# EasyEDA Pro project 51单片机.epro

# Schematic 51单片机核心板原理图
Board Name: 51单片机核心板; Create Date: 2025-05-10; Page Name: P1; Project Name: expertlearning; Schematic Name: 51单片机核心板原理图; Update Date: 2025-05-10; Company: 东北林业大学; Drawed: runb0t; Page Size: A4; Version: V1.0
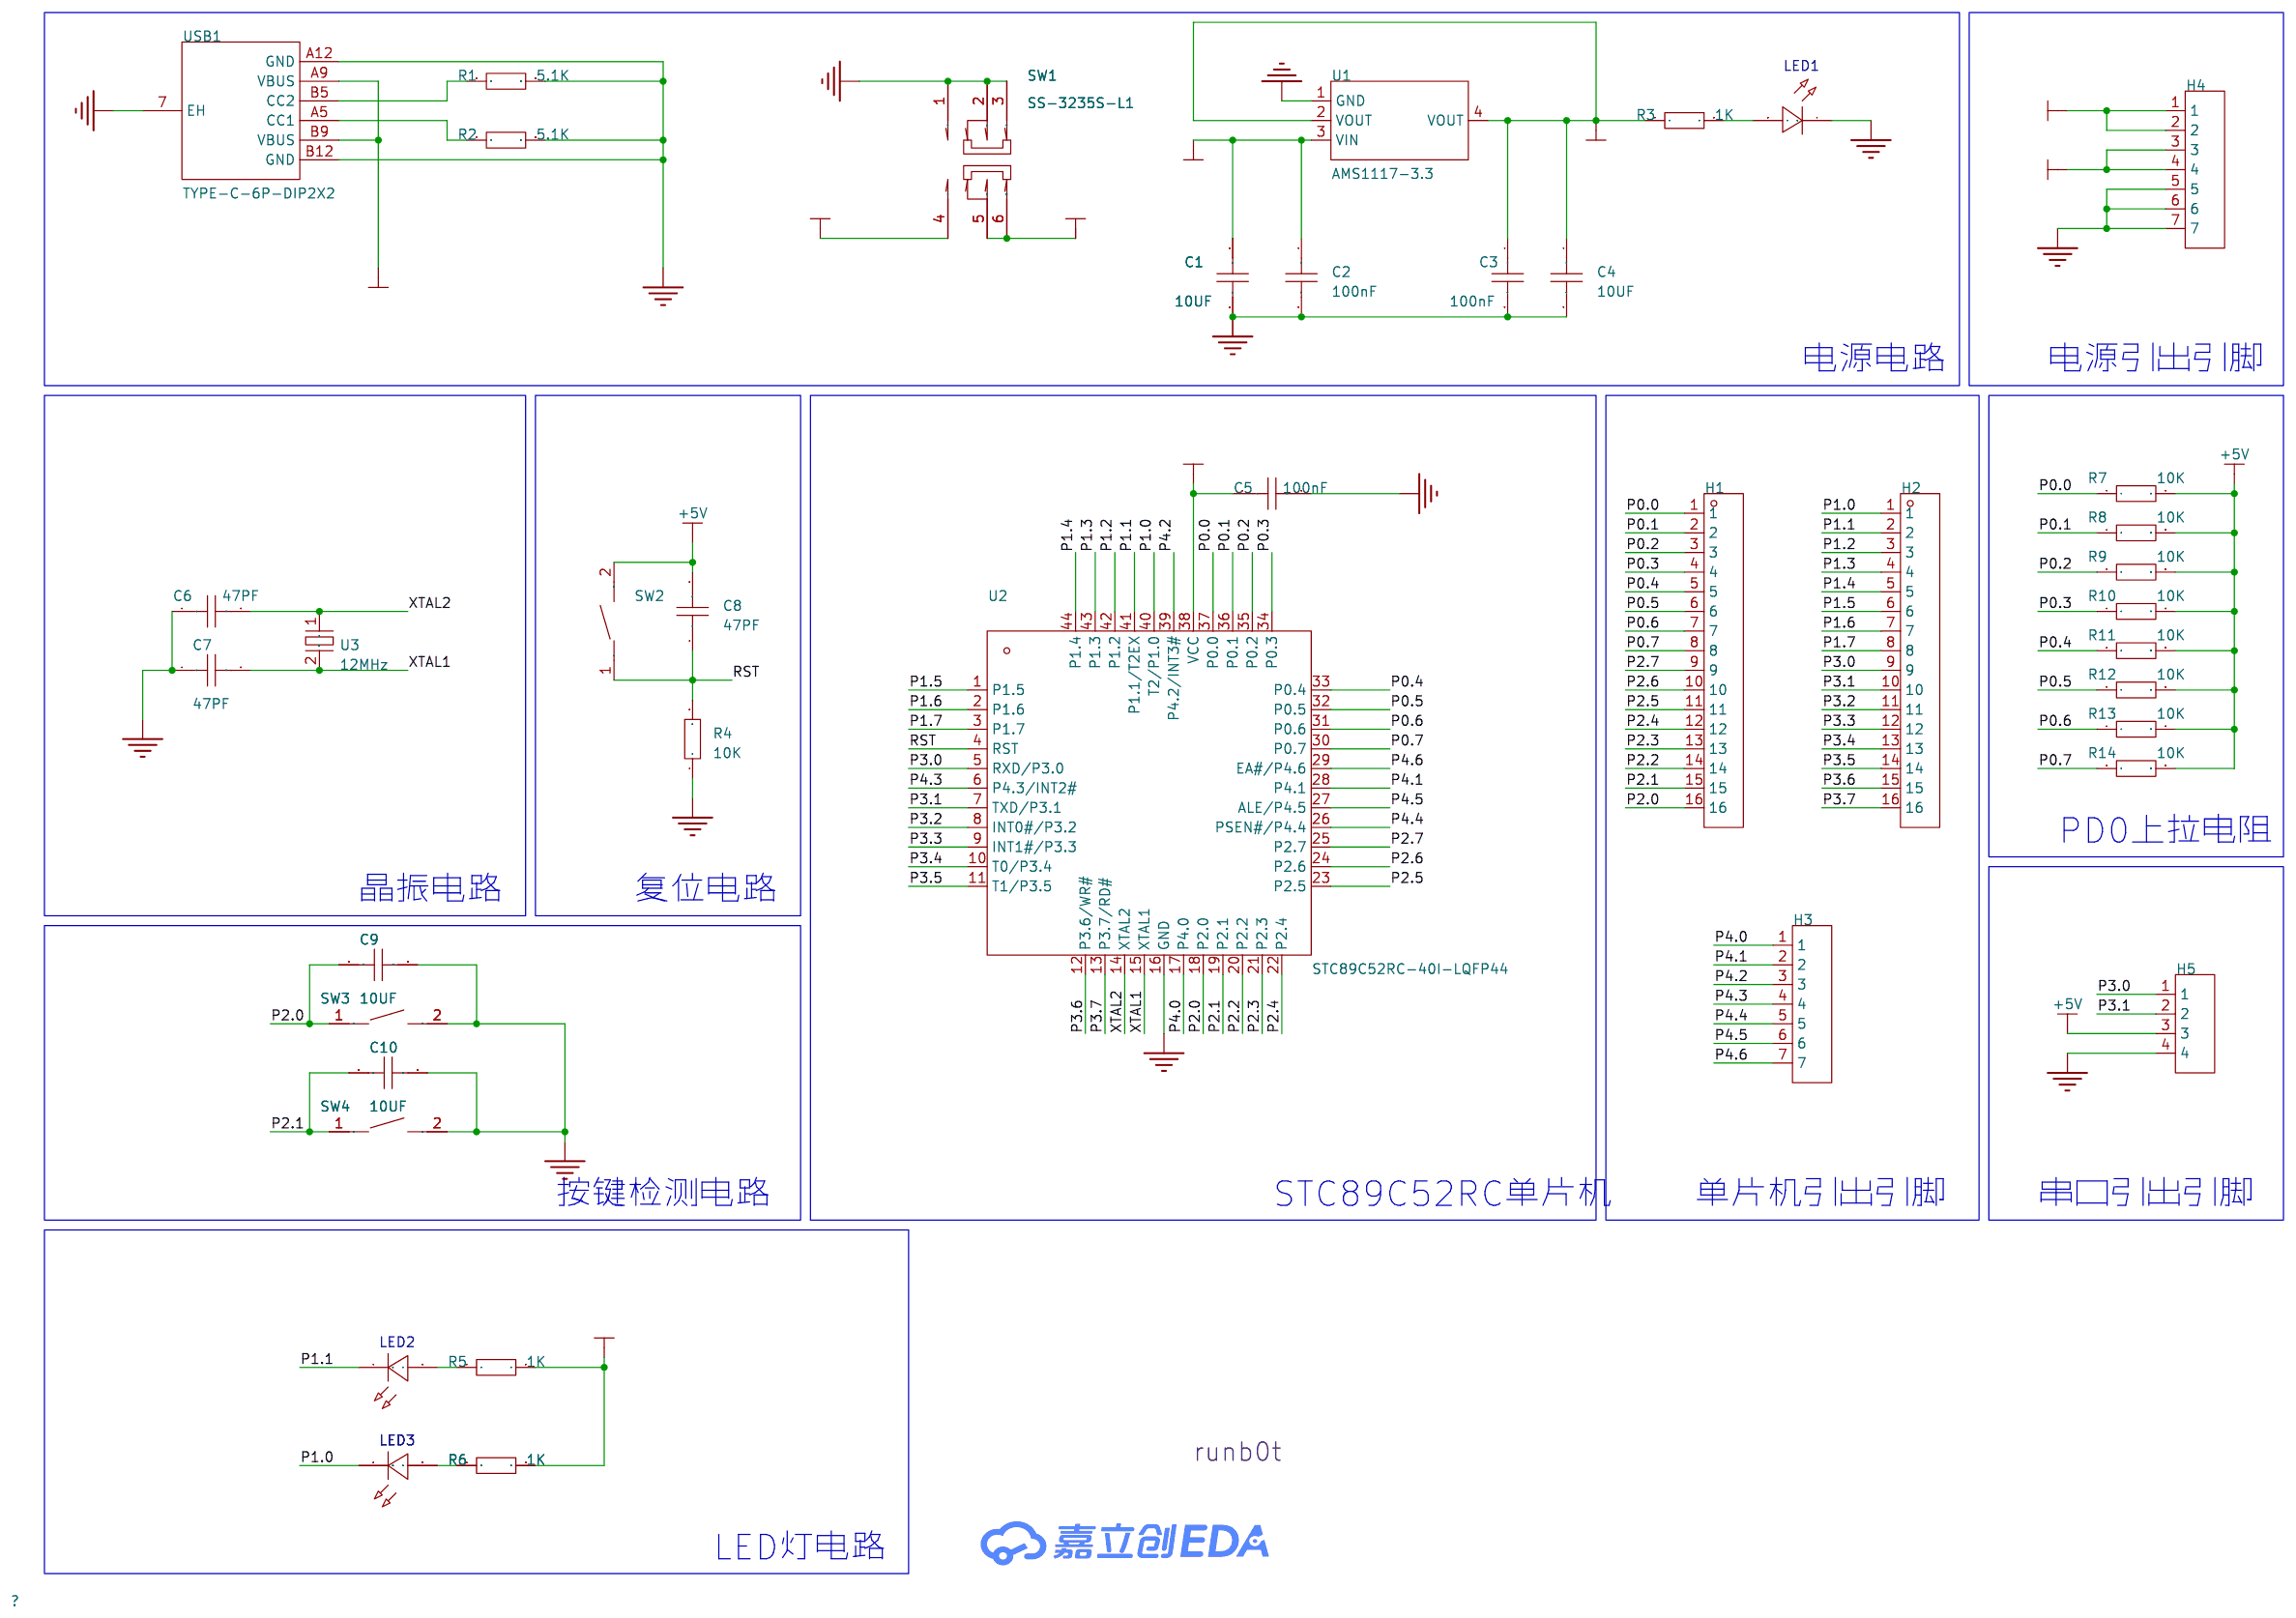
[diagram p0: schematic sheet]

## Parts
C1  10UF  [C0805]
C2  100nF  [C0805]
C3  100nF  [C0805]
C4  10UF  [C0805]
C5  100nF  [C0805]
C6  47PF  [C0805]
C7  47PF  [C0805]
C8  47PF  [C0805]
C9  10UF  [C0805]
C10  10UF  [C0805]
H1  -  [HDR-TH_16P-P2.54-V-M]
H2  -  [HDR-TH_16P-P2.54-V-M]
H3  -  [HDR-TH_7P-P2.54-V-M]
H4  -  [HDR-TH_7P-P2.54-V-M]
H5  -  [HDR-TH_4P-P2.54-V-M]
LED1  -  [LED_0805]
LED2  -  [LED_0805]
LED3  -  [LED_0805]
R1  5.1K  [R0805]
R2  5.1K  [R0805]
R3  1K  [R0805]
R4  10K  [R0805]
R5  1K  [R0805]
R6  1K  [R0805]
R7  10K  [R0805]
R8  10K  [R0805]
R9  10K  [R0805]
R10  10K  [R0805]
R11  10K  [R0805]
R12  10K  [R0805]
R13  10K  [R0805]
R14  10K  [R0805]
SW1  SS-3235S-L1  [SW-SMD_SS-3235S-LX]
SW2  轻触按键3*4*H  [SW-SMD_L4.0-W2.9-LS5.0]
SW3  轻触按键3*4*H  [SW-SMD_L4.0-W2.9-LS5.0]
SW4  轻触按键3*4*H  [SW-SMD_L4.0-W2.9-LS5.0]
U1  AMS1117-3.3  [SOT-223-3_L6.5-W3.4-P2.30-LS7.0-BR]
U2  STC89C52RC-40I-LQFP44  [LQFP-44_L10.0-W10.0-P0.80-LS12.0-BL]
U3  12MHz  [CRYSTAL-SMD_L11.4-W4.7-LS12.7]
USB1  TYPE-C-6P-DIP2X2  [TYPE-C-SMD_TYPE-C-6P]

## Library data of the parts
C1-C10 = CAP_0805: Supplier Footprint: 0805
H1 H2 = HDR-M_2.54_1x16P: 间距:2.54mm;总PIN位数:16;排数:1;插针结构:1x16P;行距:-;安装类型:直插;圆针/方针:方针;额定电流:3A;额定电压:-;配合针长度:6mm;塑高:2.5mm;端接针长度:3mm;触头材质:-;工作温度范围:-40℃~+105℃;颜色:黑色;; Supplier Part: C2894939; Supplier Footprint: 插件
H3 H4 = HDR-M_2.54_1x7P: Supplier Part: C492406; Supplier Footprint: 插件
H5 = HDR-M_2.54_1x4P: Supplier Part: C492403; Supplier Footprint: 插件
LED1-LED3 = LED_0805-G: Supplier Footprint: 0805
R1-R14 = Res_0805: Supplier Footprint: 0805
SW1 = SS-3235S-L1: 电路结构:双刀双掷;安装方式:卧贴;开关颜色:黑色;额定电流(DC):50mA;额定电压(DC):12V;额定电流(AC):50mA;额定电压(AC):12V;机械寿命:1万次;; LCSC Part Name: 柄长2mm 卧贴双档 滑动开关; Supplier Part: C500055; Manufacturer: XKB Connectivity(中国星坤); Supplier Footprint: SMD; JLCPCB Part Class: 扩展库; Datasheet: https://atta.szlcsc.com/upload/public/pdf/source/20211011/39D516E750C13BE9339464E723D9F132.pdf; Supplier: LCSC; Circuit: 双刀双掷; Actuator Style: 矩形柱状; Pin Style: 鸥翼型; Switch Length: 9.1mm; Switch Width: 3.55mm; Switch Height: 3.2mm; Mounting Style: 卧贴; Actuator Color: 黑色; Current Rating (DC): 50mA; Voltage Rating (DC): 12V; Current Rating (AC): 50mA; Voltage Rating (AC): 12V; Mechanical Life: 1万次; Operating Temperature: -40℃~+85℃
SW2-SW4 = 轻触按键3*4*H: Supplier Part: C9900017573; Supplier Footprint: 轻触按键3*4*2.5; JLCPCB Part Class: 扩展库; Supplier: LCSC
U1 = AMS1117-3.3_C6186: 输出类型:固定;工作电压:-;输出电压:3.3V;输出电流:1A;电源纹波抑制比(PSRR):72dB@(120Hz);输出极性:正极;; LCSC Part Name: 输出3.3V 1A; Supplier Part: C6186; Manufacturer: AMS; Supplier Footprint: SOT-223; JLCPCB Part Class: 基础库; Datasheet: https://atta.szlcsc.com/upload/public/pdf/source/20180727/C6186_7A095716F0823C02F1997A905E26C086.pdf; Supplier: LCSC; Output Type: 固定; Output Voltage: 3.3V; Output Current: 1A; Power Supply Rejection Ratio (PSRR): 72dB@(120Hz); Voltage Dropout: 1.3V@(800mA); Features: 过流保护(OCP)；热关断(TSD); Output Configuration: 正极; Number of Outputs: 1
U2 = STC89C52RC-40I-LQFP44: CPU内核:51系列;应用领域:-;; Supplier Part: C8707; Manufacturer: STC; Supplier Footprint: LQFP-44(10x10); JLCPCB Part Class: 扩展库; Datasheet: https://atta.szlcsc.com/upload/public/pdf/source/20241226/242305099CBBF4767F79975207B2F263.pdf; Supplier: LCSC; CPU Core: 51系列; Program Storage Size: 8KB; Program Memory Type: FLASH; Number of I/O: 39; Low Voltage Detection Threshold: 3.3V~5.5V
U3 = ABLS-12.000MHZ-B4H-T: 频率:12MHz;常温频差:±30ppm;外接负载电容:18pF;频率稳定度(全温):±35ppm;; LCSC Part Name: 12MHz ±30ppm 18pF; Supplier Part: C1986452; Manufacturer: ABRACON; Supplier Footprint: HC-49S-SMD; JLCPCB Part Class: 扩展库; Datasheet: https://atta.szlcsc.com/upload/public/pdf/source/20210612/96A8D0E14BE5C26ADD56CBF11909D043.pdf; Supplier: LCSC; Normal temperature Frequency Tolerance: ±30ppm; External load capacitor: 18pF; Frequency Stability(Full temperature range): ±35ppm; Equivalent Series Resistance (ESR): 50Ω; Operating Temperature: -20℃~+70℃
USB1 = TYPE-C-6P-DIP2X2: Supplier Part: C9900017627; Supplier Footprint: TYPE-C-6P; JLCPCB Part Class: 扩展库; Supplier: LCSC

## Nets
3.3V: C3.1 C4.1 H4.3 H4.4 R3.1 R5.2 R6.2 U1.2(VOUT) U1.4(VOUT)
+5V: C1.1 C2.1 C5.1 C8.2 H4.1 H4.2 H5.3 R7.2 R8.2 R9.2 R10.2 R11.2 R12.2 R13.2 R14.2 SW1.5 SW1.6 SW2.2 U1.3(VIN) U2.38(VCC)
GND: C1.2 C2.2 C3.2 C4.2 C5.2 C6.1 C7.1 C9.2 C10.2 H4.5 H4.6 H4.7 H5.4 LED1.1(C) R1.2 R2.2 R4.1 SW1.1 SW1.2 SW1.3 SW3.2 SW4.2 U1.1(GND) U2.16(GND) USB1.7(EH) USB1.A12(GND) USB1.B12(GND)
VCC+5V: SW1.4 USB1.A9(VBUS) USB1.B9(VBUS)
P0.0: H1.1 R7.1 U2.37(P0.0)
P0.1: H1.2 R8.1 U2.36(P0.1)
P0.2: H1.3 R9.1 U2.35(P0.2)
P0.3: H1.4 R10.1 U2.34(P0.3)
P0.4: H1.5 R11.1 U2.33(P0.4)
P0.5: H1.6 R12.1 U2.32(P0.5)
P0.6: H1.7 R13.1 U2.31(P0.6)
P0.7: H1.8 R14.1 U2.30(P0.7)
P1.0: H2.1 LED3.1(C) U2.40(T2/P1.0)
P1.1: H2.2 LED2.1(C) U2.41(P1.1/T2EX)
P1.2: H2.3 U2.42(P1.2)
P1.3: H2.4 U2.43(P1.3)
P1.4: H2.5 U2.44(P1.4)
P1.5: H2.6 U2.1(P1.5)
P1.6: H2.7 U2.2(P1.6)
P1.7: H2.8 U2.3(P1.7)
P2.0: C9.1 H1.16 SW3.1 U2.18(P2.0)
P2.1: C10.1 H1.15 SW4.1 U2.19(P2.1)
P2.2: H1.14 U2.20(P2.2)
P2.3: H1.13 U2.21(P2.3)
P2.4: H1.12 U2.22(P2.4)
P2.5: H1.11 U2.23(P2.5)
P2.6: H1.10 U2.24(P2.6)
P2.7: H1.9 U2.25(P2.7)
P3.0: H2.9 H5.1 U2.5(RXD/P3.0)
P3.1: H2.10 H5.2 U2.7(TXD/P3.1)
P3.2: H2.11 U2.8(INT0#/P3.2)
P3.3: H2.12 U2.9(INT1#/P3.3)
P3.4: H2.13 U2.10(T0/P3.4)
P3.5: H2.14 U2.11(T1/P3.5)
P3.6: H2.15 U2.12(P3.6/WR#)
P3.7: H2.16 U2.13(P3.7/RD#)
P4.0: H3.1 U2.17(P4.0)
P4.1: H3.2 U2.28(P4.1)
P4.2: H3.3 U2.39(P4.2/INT3#)
P4.3: H3.4 U2.6(P4.3/INT2#)
P4.4: H3.5 U2.26(PSEN#/P4.4)
P4.5: H3.6 U2.27(ALE/P4.5)
P4.6: H3.7 U2.29(EA#/P4.6)
RST: C8.1 R4.2 SW2.1 U2.4(RST)
XTAL1: C7.2 U2.15(XTAL1) U3.2(GND)
XTAL2: C6.2 U2.14(XTAL2) U3.1
$1N6250: R1.1 USB1.B5(CC2)
$1N6259: R2.1 USB1.A5(CC1)
$1N7041: LED1.2(A) R3.2
$1N9302: LED2.2(A) R5.1
$1N9306: LED3.2(A) R6.1

## Notes on the sheet
- 电源电路
- 电源引出引脚
- PD0上拉电阻
- 晶振电路
- 复位电路
- 按键检测电路
- STC89C52RC单片机
- 单片机引出引脚
- 串口引出引脚
- LED灯电路

# Board 51单片机核心板PCB
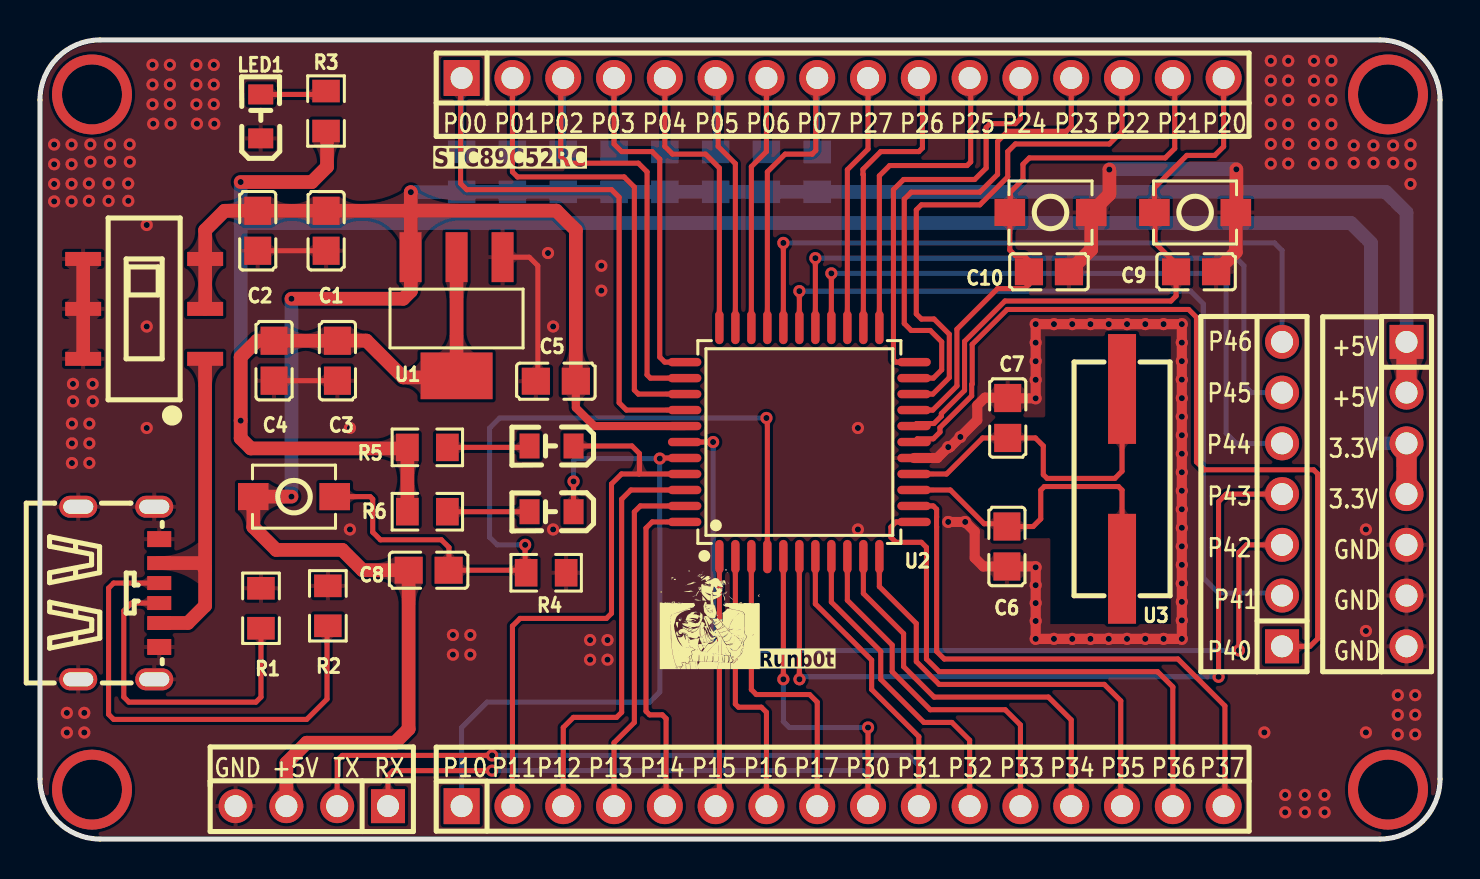
[diagram p1: board, top side]
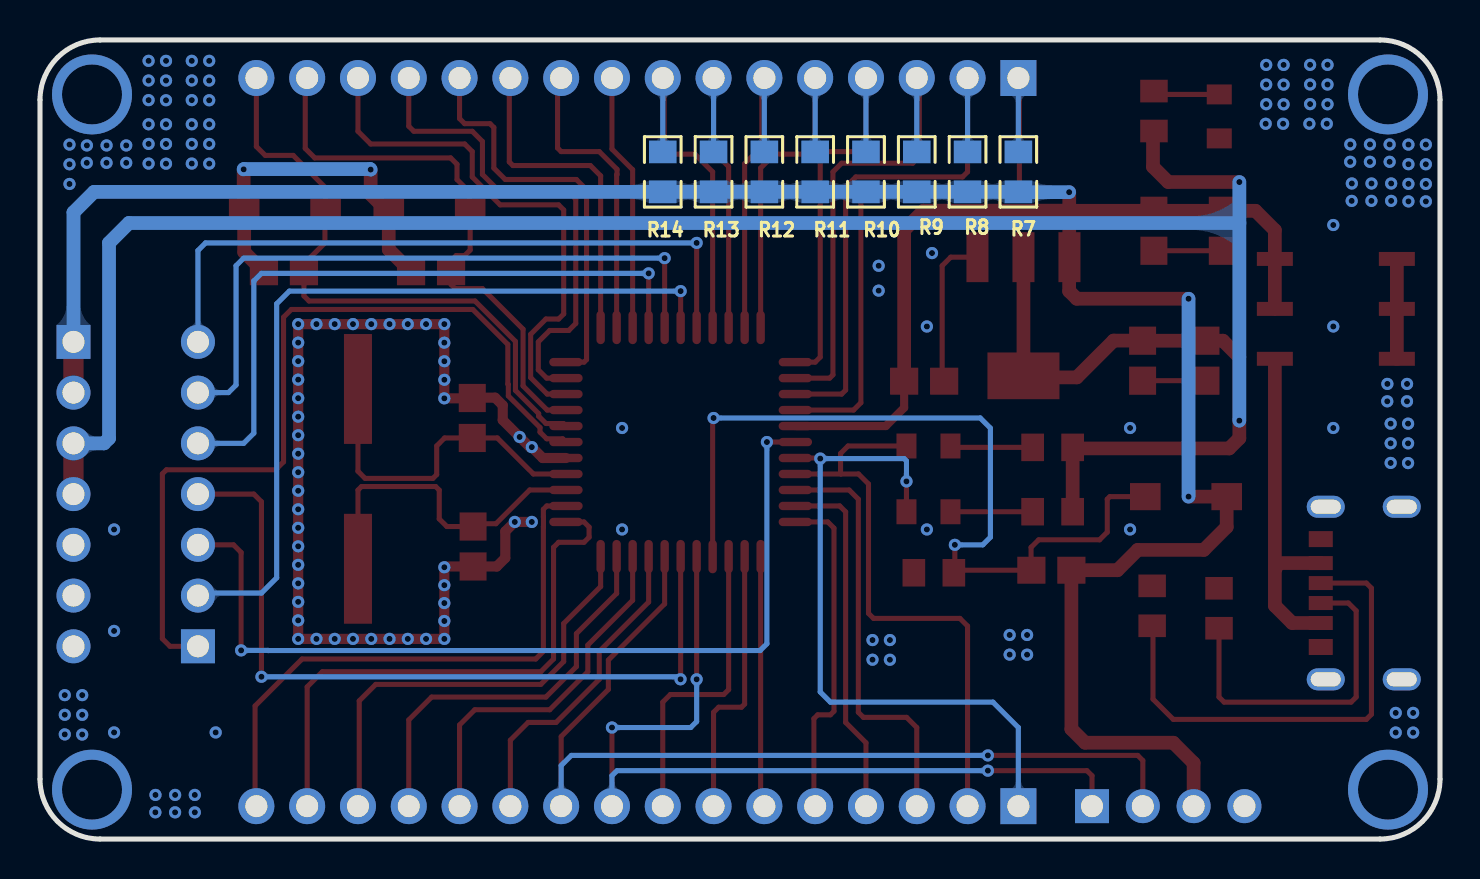
[diagram p2: board, bottom side, seen from below]

Outline 70 x 40 mm; copper layers: Top Layer, Bottom Layer. Coordinates in mm from the lower left corner of the outline.
Outline path: 0,37 0,3 arc(0.88,0.88) 3,0 67,0 arc(69.12,0.88) 70,3 70,37 arc(69.12,39.12) 67,40 3,40 arc(0.88,39.12) 0,37
Stack: Top Layer 0.035mm / Dielectric1 1.51mm FR4 er 4.5 / Bottom Layer 0.035mm

## Design rules (mm)
net XTAL2: DP1
net XTAL1: DP1
template: JLCPCB Capability(Two Layers Board)
spacing copperThickness1oz (default): track to track 0.102, other pairs 0.152 to 0.3
spacing copperThickness2oz: track to track 0.203, other pairs 0.152 to 0.3
track width copperThickness1oz (default): min 0.127, default 0.254, max 2.54
track width copperThickness2oz: min 0.203, default 0.254, max 2.54
differential pair differentialPair (default): width min 0.127, default 0.254, max 2.54; gap min 0.152, default 0.152
via viaSize (default): diameter min 0.5, default 0.61, max 10; hole min 0.3, default 0.305, max 6.3

## Placement (name value [footprint] x y rotation side)
C1  10UF  [C0805]  14.31 30.45 270 top
C2  100nF  [C0805]  10.89 30.45 270 top
C3  100nF  [C0805]  14.87 23.94 270 top
C4  10UF  [C0805]  11.7 23.94 270 top
C5  100nF  [C0805]  25.79 22.92 180 top
C6  47PF  [C0805]  48.35 14.64 90 top
C7  47PF  [C0805]  48.39 21.08 270 top
C8  47PF  [C0805]  19.43 13.46 180 top
C9  10UF  [C0805]  57.8 28.4 0 top
C10  10UF  [C0805]  50.45 28.4 0 top
H1  -  [HDR-TH_16P-P2.54-V-M]  40.13 38.09 0 top
H2  -  [HDR-TH_16P-P2.54-V-M]  40.13 1.65 0 top
H3  -  [HDR-TH_7P-P2.54-V-M]  62.1 17.27 90 top
H4  -  [HDR-TH_7P-P2.54-V-M]  68.33 17.27 270 top
H5  -  [HDR-TH_4P-P2.54-V-M]  13.59 1.65 180 top
LED1  -  [LED_0805]  11.04 36.22 90 top
LED2  -  [LED_0805]  25.53 19.68 180 top
LED3  -  [LED_0805]  25.53 16.39 180 top
R1  5.1K  [R0805]  11.05 11.55 90 top
R2  5.1K  [R0805]  14.39 11.67 90 top
R3  1K  [R0805]  14.3 36.44 90 top
R4  10K  [R0805]  25.31 13.33 180 top
R5  1K  [R0805]  19.37 19.61 180 top
R6  1K  [R0805]  19.37 16.39 180 top
R7  10K  [R0805]  21.08 33.4 270 bottom
R8  10K  [R0805]  23.62 33.4 270 bottom
R9  10K  [R0805]  26.16 33.4 270 bottom
R10  10K  [R0805]  28.7 33.4 270 bottom
R11  10K  [R0805]  31.24 33.4 270 bottom
R12  10K  [R0805]  33.78 33.4 270 bottom
R13  10K  [R0805]  36.32 33.4 270 bottom
R14  10K  [R0805]  38.86 33.4 270 bottom
SW1  SS-3235S-L1  [SW-SMD_SS-3235S-LX]  5.21 26.54 90 top
SW2  轻触按键3*4*H  [SW-SMD_L4.0-W2.9-LS5.0]  12.7 17.14 180 top
SW3  轻触按键3*4*H  [SW-SMD_L4.0-W2.9-LS5.0]  57.76 31.36 0 top
SW4  轻触按键3*4*H  [SW-SMD_L4.0-W2.9-LS5.0]  50.53 31.36 0 top
U1  AMS1117-3.3  [SOT-223-3_L6.5-W3.4-P2.30-LS7.0-BR]  20.83 26.16 90 top
U2  STC89C52RC-40I-LQFP44  [LQFP-44_L10.0-W10.0-P0.80-LS12.0-BL]  37.97 19.87 0 top
U3  12MHz  [CRYSTAL-SMD_L11.4-W4.7-LS12.7]  54.1 18.03 90 top
USB1  TYPE-C-6P-DIP2X2  [TYPE-C-SMD_TYPE-C-6P]  3.94 12.31 270 top

## Footprints (pads in the part's own frame, mm; a bottom-side part is the same pattern mirrored in y, then rotated)
C0805
  rect 1.41x1.35 smd: 1(-1,0) 2(1,0)
CRYSTAL-SMD_L11.4-W4.7-LS12.7
  rect 5.5x1.4 smd: 1(-4.5,0) 2(4.5,0)
HDR-TH_4P-P2.54-V-M
  rect 1.7x1.7 hole 1.1: 1(-3.81,0)
  round 1.7 hole 1.1: 2(-1.27,0) 3(1.27,0) 4(3.81,0)
HDR-TH_7P-P2.54-V-M
  rect 1.7x1.7 hole 1.1: 1(-7.62,0)
  round 1.7 hole 1.1: 2(-5.08,0) 3(-2.54,0) 4(0,0) 5(2.54,0) 6(5.08,0) 7(7.62,0)
HDR-TH_16P-P2.54-V-M
  rect 1.8x1.8 hole 1.1: 1(-19.05,0)
  round 1.8 hole 1.1: 2(-16.51,0) 3(-13.97,0) 4(-11.43,0) 5(-8.89,0) 6(-6.35,0) 7(-3.81,0) 8(-1.27,0) 9(1.27,0) 10(3.81,0) 11(6.35,0) 12(8.89,0) 13(11.43,0) 14(13.97,0) 15(16.51,0) 16(19.05,0)
LED_0805
  rect 1x1.25 smd: 1(-1.15,0.005) 2(1.05,0.005)
LQFP-44_L10.0-W10.0-P0.80-LS12.0-BL
  oval 0.42x1.67 smd: 1(-4,-5.735) 2(-3.2,-5.735) 3(-2.4,-5.735) 4(-1.6,-5.735) 5(-0.8,-5.735) 6(0,-5.735) 7(0.8,-5.735) 8(1.6,-5.735) 9(2.4,-5.735) 10(3.2,-5.735) 11(4,-5.735) 23(4,5.735) 24(3.2,5.735) 25(2.4,5.735) 26(1.6,5.735) 27(0.8,5.735) 28(0,5.735) 29(-0.8,5.735) 30(-1.6,5.735) 31(-2.4,5.735) 32(-3.2,5.735) 33(-4,5.735)
  oval 1.67x0.42 smd: 12(5.735,-4) 13(5.735,-3.2) 14(5.735,-2.4) 15(5.735,-1.6) 16(5.735,-0.8) 17(5.735,0) 18(5.735,0.8) 19(5.735,1.6) 20(5.735,2.4) 21(5.735,3.2) 22(5.735,4) 34(-5.735,4) 35(-5.735,3.2) 36(-5.735,2.4) 37(-5.735,1.6) 38(-5.735,0.8) 39(-5.735,0) 40(-5.735,-0.8) 41(-5.735,-1.6) 42(-5.735,-2.4) 43(-5.735,-3.2) 44(-5.735,-4)
R0805
  rect 1.133x1.377 smd: 1(-1,0) 2(1,0)
SOT-223-3_L6.5-W3.4-P2.30-LS7.0-BR
  rect 2.5x1.1 smd: 1(2.97,-2.3) 2(2.97,0) 3(2.97,2.3)
  rect 2.34x3.6 smd: 4(-2.97,0)
SW-SMD_L4.0-W2.9-LS5.0
  rect 1.53x1.36 smd: 1(-2.035,0) 2(2.035,0)
SW-SMD_SS-3235S-LX
  rect 0.7x1.8 smd: 1(-2.5,3.05) 2(0,3.05) 3(2.5,3.05) 4(-2.5,-3.05) 5(0,-3.05) 6(2.5,-3.05)
TYPE-C-SMD_TYPE-C-6P
  oval 1.1x1.9 hole 0.7x1.5: 7(-4.32,1.775) 7(-4.32,-2.025) 7(4.32,1.775) 7(4.32,-2.025)
  rect 0.7x1.2 smd: A5(-0.5,2.025) A9(1.5,2.025) B5(0.5,2.025) B9(-1.5,2.025)
  rect 0.8x1.2 smd: A12(2.7,2.025) B12(-2.7,2.025)

## Nets
As in the schematic.

## Via types
v1: diameter 4, hole 3, Top Layer to Bottom Layer, 4 vias
v2: diameter 0.61, hole 0.305, Top Layer to Bottom Layer, 188 vias

## Routing (per net, layer and track width the routed paths; a pad name or vN(x,y) marks a point on that pad's centre or on a via; arc(x,y) is an arc through that point)
3.3V: length 123.2
  Top Layer w0.686: U1.2 U1.4 20.75,23.11 18.16,23.11 16.32,24.95 14.37,24.95 14.36,24.94 C4.1 10.85,24.94 10.03,24.12 v2(10.03,20.94) 10.03,20.06 10.54,19.55 18.31,19.55 R5.2 R6.2 ; v2(10.03,32.89) 13.59,32.89 14.35,33.65 14.35,35.39 R3.1
  Top Layer w1.016: H4.3 H4.4
  Bottom Layer w0.686: H4.3 66.8,19.81 66.55,20.06 66.55,29.84 65.55,30.84 10.03,30.84 ; 10.03,30.84 v2(10.03,20.94) ; 10.03,30.84 v2(10.03,32.89)
+5V: length 147.2
  Top Layer w0.406: C5.1 26.79,21.59 27.71,20.67 U2.38
  Top Layer w0.686: 18.54,31.46 18.54,32.38 v2(18.54,32.38) ; 18.54,31.46 25.82,31.46 26.79,30.48 C5.1 ; 18.54,31.46 18.53,31.45 C1.1 C2.1 9.23,31.45 8.26,30.48 SW1.6 SW1.5 ; 18.54,31.46 18.54,29.14 U1.3 18.54,29.11 18.54,27.43 18.16,27.05 v2(12.57,27.05) ; v2(12.57,17.14) SW2.2 10.67,15.62 11.81,14.47 15.11,14.47 16.13,13.46 C8.2 18.43,5.51 17.75,4.82 13.33,4.82 12.32,3.8 H5.3
  Top Layer w1.016: H4.1 H4.2
  Bottom Layer w0.686: v2(18.54,32.38) 21.07,32.38 R7.2 R8.2 R9.2 R10.2 R11.2 R12.2 R13.2 R14.2 67.29,32.4 68.33,31.36 H4.1 ; v2(12.57,17.14) v2(12.57,27.05)
GND: length 88.8
  Top Layer w0.254: C5.2 24.89,23.02 24.89,28.7 24.46,29.13 U1.1 ; C3.2 C4.2 ; C1.2 C2.2
  Top Layer w0.508: v2(45.41,15.87) v2(46.26,15.87) 46.74,15.4 46.74,14.07 47.16,13.64 C6.1 49.74,13.64 v2(49.78,13.6) v2(49.78,12.71) v2(49.78,11.81) v2(49.78,10.91) v2(49.78,10.02) v2(50.7,10.02) v2(51.61,10.02) v2(52.52,10.02) v2(53.44,10.02) v2(54.35,10.02) v2(55.26,10.02) v2(56.18,10.02) v2(57.09,10.02) v2(57.09,10.95) v2(57.09,11.87) v2(57.09,12.8) v2(57.09,13.73) v2(57.09,14.65) v2(57.09,15.58) v2(57.09,16.51) v2(57.09,17.43) v2(57.09,18.36) v2(57.09,19.29) v2(57.09,20.21) v2(57.09,21.14) v2(57.09,22.07) v2(57.09,23) v2(57.09,23.92) v2(57.09,24.85) v2(57.09,25.78) v2(56.18,25.78) v2(55.26,25.78) v2(54.35,25.78) v2(53.44,25.78) v2(52.52,25.78) v2(51.61,25.78) v2(50.7,25.78) v2(49.78,25.78) v2(49.78,24.85) v2(49.78,23.92) v2(49.78,22.99) v2(49.78,22.06) 48.4,22.06 C7.1 48.37,22.09 47.24,22.09 46.86,21.71 46.86,20.97 v2(46.02,20.13) 45.51,19.62 v2(45.41,19.62) 44.86,19.07 U2.16
  Top Layer w0.686: C10.2 52.56,29.51 SW4.2 53.47,32.27 v2(53.47,33.51) ; SW1.1 SW1.2 SW1.3 ; v2(59.82,33.52) 59.82,31.39 SW3.2 59.79,29.38 C9.2
  Bottom Layer w0.686: v2(59.82,33.52) 59.8,33.54 53.49,33.54 v2(53.47,33.51)
  vias: v2(0.71,34.76) v2(0.71,33.78) v2(0.71,32.79) v2(0.71,31.92) v2(1.34,6.32) v2(1.34,5.33) v2(1.58,34.76) v2(1.58,33.78) v2(1.58,32.8) v2(1.58,31.92) v2(1.65,22.78) v2(1.6,20.79) v2(1.6,19.81) v2(1.6,18.82) v2(1.65,21.91) v2(2.21,6.32) v2(2.21,5.33) v2(2.44,32.82) v2(2.44,31.94) v2(2.52,34.77) v2(2.52,33.9) v2(2.47,20.79) v2(2.47,19.81) v2(2.47,18.83) v2(2.63,22.78) v2(2.64,21.91) v2(3.43,32.82) v2(3.43,31.94) v2(3.5,34.77) v2(3.5,33.9) v2(4.41,32.82) v2(4.42,31.94) v2(4.49,34.77) v2(4.49,33.9) v2(5.34,30.74) v2(5.34,25.66) v2(5.34,20.58) v2(5.62,38.75) v2(5.62,37.77) v2(5.62,36.78) v2(5.66,35.8) v2(6.5,38.75) v2(6.5,37.77) v2(6.5,36.79) v2(6.53,35.8) v2(7.82,38.75) v2(7.82,37.76) v2(7.82,36.78) v2(7.84,35.8) v2(8.69,38.75) v2(8.69,37.77) v2(8.69,36.78) v2(8.72,35.8) v2(15.5,20.58) v2(15.5,15.5) v2(20.65,10.22) v2(20.65,9.23) v2(21.52,10.22) v2(21.52,9.23) v2(25.4,29.33) v2(25.66,25.66) v2(25.66,15.5) v2(27.5,9.96) v2(27.5,8.97) v2(28.07,28.7) v2(28.07,27.45) v2(28.38,9.96) v2(28.38,8.98) v2(40.9,20.58) v2(40.9,15.5) v2(61.22,5.34) v2(61.54,38.95) v2(61.54,37.97) v2(61.54,36.98) v2(61.54,35.78) v2(61.54,34.79) v2(61.54,33.81) v2(62.26,2.21) v2(62.26,1.34) v2(62.41,38.95) v2(62.41,37.97) v2(62.41,36.99) v2(62.41,35.78) v2(62.41,34.8) v2(62.41,33.81) v2(63.24,2.21) v2(63.25,1.34) v2(63.7,38.95) v2(63.7,37.97) v2(63.7,36.98) v2(63.7,35.78) v2(63.7,34.79) v2(63.7,33.81) v2(64.23,2.21) v2(64.23,1.34) v2(64.57,38.95) v2(64.57,37.97) v2(64.57,36.99) v2(64.57,35.78) v2(64.57,34.8) v2(64.57,33.81) v2(65.69,34.72) v2(65.69,33.85) v2(66.3,15.5) v2(66.3,10.42) v2(66.3,5.34) v2(66.67,34.72) v2(66.68,33.85) v2(67.66,34.72) v2(67.66,33.85) v2(67.89,7.2) v2(67.89,6.22) v2(67.89,5.23) v2(68.53,34.76) v2(68.53,33.78) v2(68.53,32.79) v2(68.76,7.2) v2(68.76,6.22) v2(68.76,5.24)
VCC+5V: length 17.6
  Top Layer w0.686: USB1.B9 8.21,13.81 8.21,13.58 ; 8.21,13.58 8.25,13.58 8.25,23.91 8.38,24.04 ; 8.21,13.58 8.25,13.54 8.25,11.68 7.39,10.81 USB1.A9
(no net):
  vias: v1(2.6,37.27) v1(2.6,2.47) v1(67.4,37.27) v1(67.4,2.47)
P0.0: length 30.9
  Top Layer w0.254: U2.37 29.32,21.47 28.96,21.84 28.96,32.13 28.57,32.51 21.34,32.51 21.03,32.81 21.03,38.04 H1.1
  Bottom Layer w0.254: H1.1 R7.1
P0.1: length 27.6
  Top Layer w0.254: H1.2 23.62,33.4 23.88,33.14 29.21,33.14 29.72,32.63 29.72,22.47 29.92,22.27 U2.36
  Bottom Layer w0.254: H1.2 R8.1
P0.2: length 24.4
  Top Layer w0.254: H1.3 26.03,37.97 26.03,34.16 26.36,33.83 29.92,33.83 30.35,33.4 30.35,23.24 30.52,23.07 U2.35
  Bottom Layer w0.254: H1.3 R9.1
P0.3: length 20.9
  Top Layer w0.254: H1.4 28.7,34.79 29.08,34.41 30.61,34.41 30.99,34.03 30.99,24.12 31.24,23.87 U2.34
  Bottom Layer w0.254: H1.4 R10.1
P0.4: length 18.3
  Top Layer w0.254: H1.5 31.24,34.67 31.62,34.28 33.27,34.28 33.97,33.59 U2.33
  Bottom Layer w0.254: H1.5 R11.1
P0.5: length 16.6
  Top Layer w0.254: U2.32 34.77,33.81 33.91,34.67 33.91,37.97 H1.6
  Bottom Layer w0.254: H1.6 R12.1
P0.6: length 16.5
  Top Layer w0.254: H1.7 36.32,34.41 35.57,33.66 U2.31
  Bottom Layer w0.254: H1.7 R13.1
P0.7: length 18
  Top Layer w0.254: H1.8 38.79,38.02 38.79,34.46 38.61,34.28 37.26,34.28 36.37,33.4 U2.30
  Bottom Layer w0.254: H1.8 R14.1
P1.0: length 34.4
  Top Layer w0.254: LED3.1 v2(26.68,17.9) ; v2(30.99,19.04) 31.02,19.07 U2.40
  Bottom Layer w0.254: v2(26.68,17.9) 26.68,18.92 26.8,19.04 v2(30.99,19.04) 30.99,7.36 30.48,6.85 22.35,6.85 21.08,5.58 H2.1
P1.1: length 29.1
  Top Layer w0.254: 29.95,18.27 29.07,18.27 28.57,17.77 28.57,11.3 28.32,11.04 24,11.04 23.62,10.66 H2.2 ; 29.95,18.27 U2.41 ; 29.95,18.27 29.97,18.29 29.97,19.3 29.6,19.67 LED2.1
P1.2: length 21.2
  Top Layer w0.254: U2.42 29.54,17.47 29.08,17.01 29.08,6.34 28.83,6.09 26.67,6.09 26.16,5.58 H2.3
P1.3: length 17.8
  Top Layer w0.254: U2.43 30.01,16.67 29.72,16.38 29.72,5.84 28.7,4.82 H2.4
P1.4: length 16.8
  Top Layer w0.254: H2.5 31.31,1.71 31.31,6.03 31.12,6.22 30.48,6.22 30.3,6.4 30.3,15.56 30.61,15.87 U2.44
P1.5: length 12.6
  Top Layer w0.254: H2.6 33.97,1.83 U2.1
P1.6: length 13.8
  Top Layer w0.254: H2.7 36.32,6.34 36.07,6.6 34.93,6.6 34.77,6.76 U2.2
P1.7: length 15.4
  Top Layer w0.254: U2.3 35.57,7.48 35.81,7.23 38.48,7.23 38.86,6.85 H2.8
P2.0: length 31
  Top Layer w0.254: H1.16 59.18,34.67 58.74,34.22 57.34,34.22 55.72,32.6 55.72,31.11 ; 55.72,31.11 55.75,31.08 55.75,29.84 56.8,28.79 56.8,27.19 56.55,26.93 48.25,26.93 46.23,24.91 46.23,22.46 45.07,21.3 45.07,21.17 44.7,20.8 43.83,20.8 U2.18 ; 55.72,31.11 55.72,31.08
P2.1: length 28.7
  Top Layer w0.254: H1.15 56.74,38 56.74,34.57 56.26,34.09 49.47,34.09 49.15,33.78 49.15,33.01 48.51,32.38 48.51,31.13 48.49,31.11 ; 48.49,31.11 48.49,29.48 48.77,29.2 49.19,29.2 49.45,28.95 49.45,27.76 49.24,27.55 47.88,27.55 45.85,25.52 45.85,22.68 44.64,21.47 U2.19 ; 48.49,31.11 SW4.1
P2.2: length 26.9
  Top Layer w0.254: U2.20 44.64,22.27 45.47,23.1 45.47,25.27 44.7,26.03 44.07,26.03 43.81,26.28 43.81,31.49 44.07,31.74 46.99,31.74 48.39,33.14 48.39,34.41 48.77,34.79 53.47,34.79 54.1,35.43 H1.14
P2.3: length 24.7
  Top Layer w0.254: U2.21 44.67,23.07 45.09,23.49 45.09,24.89 44.51,25.46 43.56,25.46 43.21,25.81 43.21,32.03 43.56,32.38 46.99,32.38 47.88,33.27 47.88,34.92 48.39,35.43 51.31,35.43 51.56,35.68 H1.13
P2.4: length 20.6
  Top Layer w0.254: H1.12 49.02,36.06 48.77,35.81 47.5,35.81 47.31,35.62 47.31,33.59 46.74,33.01 43.18,33.01 42.67,32.51 42.67,24 42.8,23.87 U2.22
P2.5: length 16.7
  Top Layer w0.254: U2.23 41.97,33.2 42.48,33.71 46.35,33.71 46.53,33.89 46.53,38.04 H1.11
P2.6: length 14.9
  Top Layer w0.254: U2.24 41.17,33.25 41.15,33.27 41.15,33.52 42.04,34.41 43.94,34.41 44.12,34.59 44.12,37.92 H1.10
P2.7: length 12.9
  Top Layer w0.254: H1.9 41.4,34.54 40.37,33.5 U2.25
P3.0: length 43.8
  Top Layer w0.254: v2(41.4,5.58) H2.9 ; v2(22.61,3.42) 17.65,3.42 17.4,3.17 H5.1 ; U2.5 v2(37.17,8)
  Bottom Layer w0.254: H2.9 41.4,3.17 41.15,3.42 v2(22.61,3.42) ; v2(37.17,8) 37.17,5.88 37.47,5.58 v2(41.4,5.58)
P3.1: length 48.4
  Top Layer w0.254: H5.2 14.86,3.93 15.11,4.19 v2(22.61,4.19) ; H2.10 43.94,5.13 41.58,7.49 41.58,8.96 38.77,11.77 U2.7
  Bottom Layer w0.254: H2.10 43.94,3.68 43.43,4.19 v2(22.61,4.19)
P3.2: length 16.2
  Top Layer w0.254: U2.8 39.57,11.86 42.04,9.39 42.04,8 44.2,5.84 45.59,5.84 46.48,4.95 H2.11
P3.3: length 18.3
  Top Layer w0.254: U2.9 40.37,11.95 42.61,9.71 42.61,8.38 44.51,6.47 48.26,6.47 49.02,5.71 H2.12
P3.4: length 20.1
  Top Layer w0.254: H2.13 51.56,5.96 50.42,7.11 44.7,7.11 43.18,8.63 43.18,10.28 41.17,12.29 U2.10
P3.5: length 22.4
  Top Layer w0.254: U2.11 41.97,12.64 43.81,10.79 43.81,8.88 44.96,7.74 53.21,7.74 54.04,6.92 54.04,1.71 H2.14
P3.6: length 28.2
  Top Layer w0.254: H2.15 56.64,7.61 55.88,8.38 44.96,8.38 44.32,9.01 44.32,14.6 44.07,14.85 42.8,14.85 42.54,15.11 42.54,15.62 42.8,15.87 U2.12
P3.7: length 28.9
  Top Layer w0.254: H2.16 59.25,1.71 59.25,6.66 56.9,9.01 45.21,9.01 44.83,9.39 44.83,15.63 44.83,15.63 44.83,16.11 44.83,16.12 44.83,16.5 44.66,16.67 U2.13
P4.0: length 42.4
  Top Layer w0.254: U2.17 43.87,20.04 44.66,20.04 45,20.37 45,20.6 46.58,22.18 46.58,22.75 46.61,22.78 46.61,24.76 48.36,26.51 57.43,26.51 57.82,26.12 57.82,18.88 58.22,18.48 63.68,18.48 63.88,18.28 63.88,10.03 63.5,9.65 H3.1
P4.1: length 40.3
  Top Layer w0.254: U2.28 v2(37.97,27.43)
  Bottom Layer w0.254: H3.2 61.98,12.31 58.93,12.31 58.17,13.08 58.17,26.79 57.53,27.43 v2(37.97,27.43)
P4.2: length 45.2
  Top Layer w0.254: v2(59.94,9.44) 59.94,14.35 60.32,14.73 H3.3 ; U2.39 v2(33.66,19.87)
  Bottom Layer w0.254: v2(33.66,19.87) 33.66,9.77 33.99,9.43 58.59,9.43 58.6,9.44 v2(59.94,9.44)
P4.3: length 39.2
  Top Layer w0.254: v2(37.97,8) 37.97,8 U2.6 ; v2(58.93,8.12) 58.93,16.89 59.31,17.27 H3.4
  Bottom Layer w0.254: v2(58.93,8.12) 38.1,8.12 v2(37.97,8)
P4.4: length 33.2
  Top Layer w0.254: U2.26 v2(39.57,28.32)
  Bottom Layer w0.254: v2(39.57,28.32) 58.93,28.32 59.31,27.93 59.31,20.31 59.82,19.81 H3.5
P4.5: length 33.1
  Top Layer w0.254: U2.27 v2(38.77,29.08)
  Bottom Layer w0.254: H3.6 60.58,22.35 60.2,22.73 60.2,28.7 59.82,29.08 v2(38.77,29.08)
P4.6: length 33.9
  Top Layer w0.254: U2.29 v2(37.17,29.84)
  Bottom Layer w0.254: v2(37.17,29.84) 61.72,29.84 62.1,29.46 H3.7
RST: length 42.6
  Top Layer w0.254: v2(24.26,14.73) 24.26,13.38 ; 24.26,13.38 24.18,13.46 C8.1 20.45,13.47 20.45,14.6 20.07,14.98 17.02,14.98 16.64,15.36 16.64,17.01 16.51,17.14 SW2.1 ; 24.26,13.38 R4.2 ; U2.4 36.37,21.03 v2(36.32,21.08)
  Bottom Layer w0.254: v2(24.26,14.73) 22.86,14.73 22.48,15.11 22.48,20.57 22.99,21.08 v2(36.32,21.08)
XTAL1: length 17.1
  Top Layer w0.254: U2.15 45.33,18.27 47.13,20.08 C7.2 49.77,20.08 50.16,19.68 50.16,18.24 50.36,18.05 53.74,18.05 54.1,18.41 U3.2
XTAL2: length 16.8
  Top Layer w0.254: U2.14 45.51,17.47 47.2,15.78 48.21,15.78 C6.2 49.66,15.64 50.04,16.03 50.04,17.47 50.22,17.65 53.92,17.65 54.1,17.47 U3.1
$1N6250: length 16.8
  Top Layer w0.254: R1.1 11.05,7.11 10.8,6.85 4.44,6.85 4.19,7.11 4.19,11.42 4.58,11.81 USB1.B5
$1N6259: length 24.1
  Top Layer w0.254: USB1.A5 3.68,12.81 3.43,12.56 3.43,6.24 3.68,5.99 13.33,5.99 14.35,7 14.35,10.63 R2.1
$1N7041: length 3.3
  Top Layer w0.254: LED1.2 14.13,37.27 R3.2
$1N9302: length 4.1
  Top Layer w0.254: R5.1 24.41,19.61 LED2.2
$1N9306: length 4.1
  Top Layer w0.254: R6.1 24.47,16.39 LED3.2

## Copper pours and planes (outline as drawn; the poured copper is in the pictures)
GND on Top Layer: -3.05,41.52 72.77,41.52 72.77,-3.18 -3.05,-3.18

Small or netless copper shapes (teardrops, artwork), in the pictures only: 257 on Top Layer, 59 on Bottom Layer

## Text on the board
Top Silkscreen Layer: GND | +5V | TX | RX | P00 | P10 | P11 | P01 | P12 | P02 | P13 | P03 | P14 | P04 | P15 | P05 | P16 | P06 | P17 | P07 | P30 | P27 | P31 | P26 | P32 | P25 | P33 | P24 | P34 | P23 | P35 | P22 | P36 | P21 | P37 | P20 | P44 | P45 | P43 | P42 | P40 | P46 | P41 | 3.3V | Runb0t | STC89C52RC
